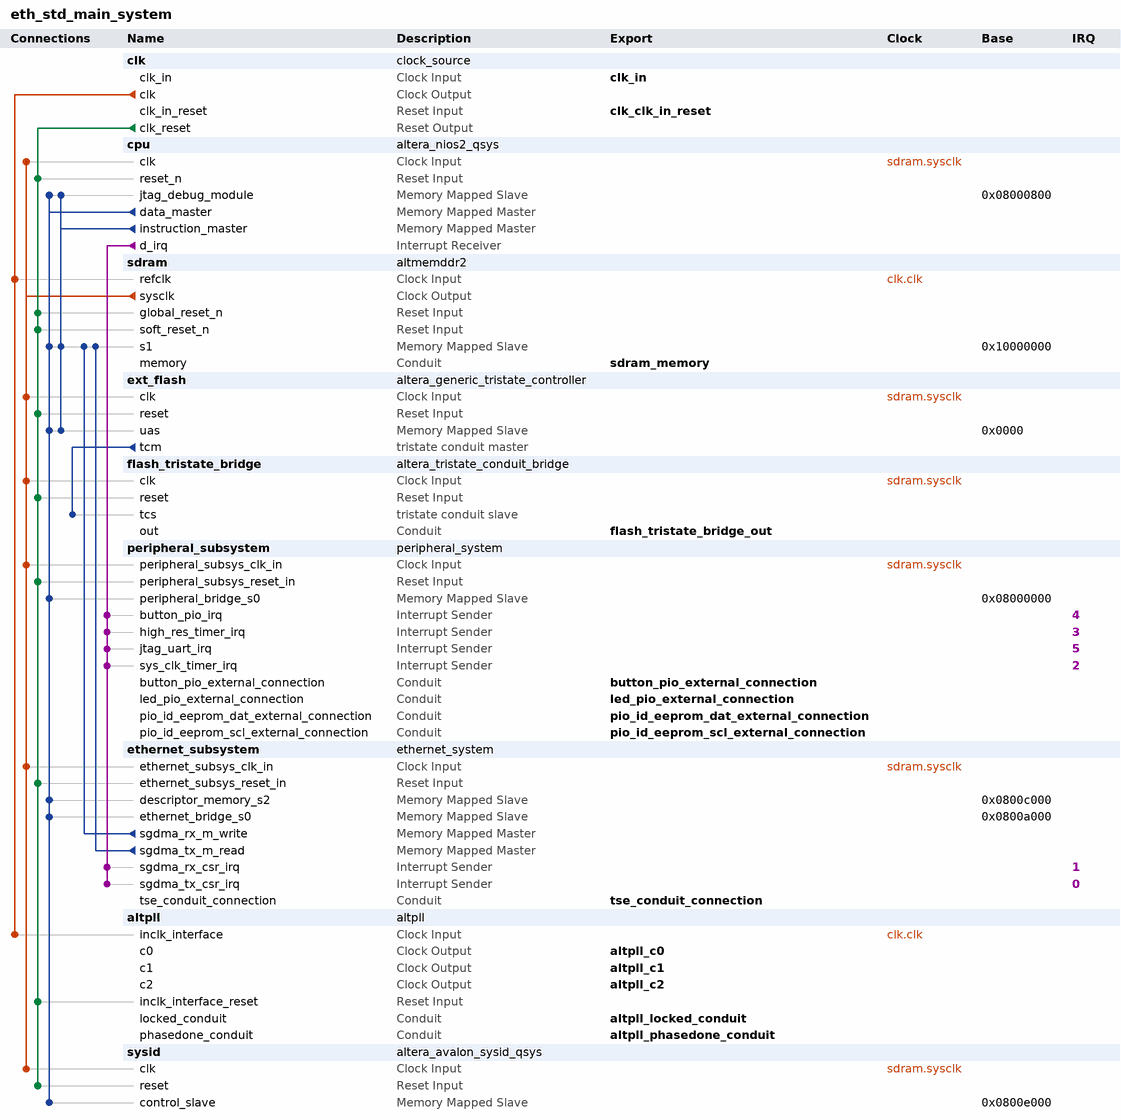
[diagram p0: system contents]
# Platform Designer (Qsys) system eth_std_main_system
# Parameters at their usual value, and those the tool derives, are not listed.
package require -exact qsys 11.0
create_system eth_std_main_system
set_project_property DEVICE_FAMILY CYCLONEIII

add_instance clk clock_source 11.0
set_instance_parameter_value clk clockFrequency 50000000

add_instance cpu altera_nios2_qsys 11.0
set_instance_parameter_value cpu muldiv_divider true
set_instance_parameter_value cpu mmu_autoAssignTlbPtrSz false
set_instance_parameter_value cpu manuallyAssignCpuID false
set_instance_parameter_value cpu exceptionOffset 288
set_instance_parameter_value cpu resetSlave ext_flash.uas
set_instance_parameter_value cpu exceptionSlave sdram.s1
set_instance_parameter_value cpu breakSlave cpu.jtag_debug_module
set_instance_parameter_value cpu impl Fast
set_instance_parameter_value cpu icache_size 32768
set_instance_parameter_value cpu dcache_size 32768

add_instance sdram altmemddr2 11.0
set_instance_parameter_value sdram pipeline_commands true
set_instance_parameter_value sdram debug_en false
set_instance_parameter_value sdram export_debug_port false
set_instance_parameter_value sdram use_generated_memory_model true
set_instance_parameter_value sdram dedicated_memory_clk_phase_label {Dedicated memory clock phase:}
set_instance_parameter_value sdram mem_if_clk_mhz 125.0
set_instance_parameter_value sdram quartus_project_exists false
set_instance_parameter_value sdram local_if_drate Half
set_instance_parameter_value sdram enable_v72_rsu false
set_instance_parameter_value sdram local_if_clk_mhz_label 62.5
set_instance_parameter_value sdram new_variant true
set_instance_parameter_value sdram mem_if_memtype {DDR2 SDRAM}
set_instance_parameter_value sdram pll_ref_clk_mhz 50.0
set_instance_parameter_value sdram mem_if_clk_ps_label {(8000 ps)}
set_instance_parameter_value sdram family {Cyclone III}
set_instance_parameter_value sdram project_family {Cyclone III}
set_instance_parameter_value sdram speed_grade 7
set_instance_parameter_value sdram dedicated_memory_clk_phase 0
set_instance_parameter_value sdram pll_ref_clk_ps_label {(20000 ps)}
set_instance_parameter_value sdram avalon_burst_length 1
set_instance_parameter_value sdram mem_if_clk_pair_count 1
set_instance_parameter_value sdram mem_if_cs_per_dimm 1
set_instance_parameter_value sdram pre_latency_label {Fix read latency at:}
set_instance_parameter_value sdram dedicated_memory_clk_en false
set_instance_parameter_value sdram mirror_addressing 0
set_instance_parameter_value sdram mem_if_bankaddr_width 2
set_instance_parameter_value sdram register_control_word_9 0000
set_instance_parameter_value sdram mem_if_rowaddr_width 13
set_instance_parameter_value sdram mem_dyn_deskew_en false
set_instance_parameter_value sdram post_latency_label {cycles (0 cycles=minimum latency, non-deterministic)}
set_instance_parameter_value sdram mem_if_dm_pins_en Yes
set_instance_parameter_value sdram local_if_dwidth_label 32
set_instance_parameter_value sdram register_control_word_7 0000
set_instance_parameter_value sdram register_control_word_8 0000
set_instance_parameter_value sdram mem_if_preset {Custom (Micron MT47H32M16CC-3)}
set_instance_parameter_value sdram mem_if_pchaddr_bit 10
set_instance_parameter_value sdram WIDTH_RATIO 4
set_instance_parameter_value sdram vendor Micron
set_instance_parameter_value sdram register_control_word_3 0000
set_instance_parameter_value sdram register_control_word_4 0000
set_instance_parameter_value sdram chip_or_dimm {Discrete Device}
set_instance_parameter_value sdram register_control_word_5 0000
set_instance_parameter_value sdram register_control_word_6 0000
set_instance_parameter_value sdram mem_fmax 333.333
set_instance_parameter_value sdram register_control_word_0 0000
set_instance_parameter_value sdram register_control_word_size 4
set_instance_parameter_value sdram register_control_word_1 0000
set_instance_parameter_value sdram register_control_word_2 0000
set_instance_parameter_value sdram register_control_word_11 0000
set_instance_parameter_value sdram register_control_word_10 0000
set_instance_parameter_value sdram mem_if_cs_width 1
set_instance_parameter_value sdram mem_if_preset_rlat 0
set_instance_parameter_value sdram mem_if_cs_per_rank 1
set_instance_parameter_value sdram fast_simulation_en FAST
set_instance_parameter_value sdram register_control_word_15 0000
set_instance_parameter_value sdram register_control_word_14 0000
set_instance_parameter_value sdram mem_if_dwidth 8
set_instance_parameter_value sdram mem_if_dq_per_dqs 8
set_instance_parameter_value sdram mem_if_coladdr_width 10
set_instance_parameter_value sdram register_control_word_13 0000
set_instance_parameter_value sdram register_control_word_12 0000
set_instance_parameter_value sdram mem_tiha_ps 400
set_instance_parameter_value sdram mem_tdsh_ck 0.2
set_instance_parameter_value sdram mem_if_trfc_ns 105.0
set_instance_parameter_value sdram mem_tqh_ck 0.36
set_instance_parameter_value sdram mem_tisa_ps 400
set_instance_parameter_value sdram mem_tdss_ck 0.2
set_instance_parameter_value sdram mem_trtp_ns 8.8
set_instance_parameter_value sdram mem_if_tinit_us 200.0
set_instance_parameter_value sdram mem_if_trcd_ns 15.0
set_instance_parameter_value sdram mem_if_twtr_ck 3
set_instance_parameter_value sdram mem_trrd_ns 10.0
set_instance_parameter_value sdram mem_tdqss_ck 0.25
set_instance_parameter_value sdram mem_tqhs_ps 340
set_instance_parameter_value sdram mem_tdsa_ps 300
set_instance_parameter_value sdram mem_tac_ps 450
set_instance_parameter_value sdram mem_tdha_ps 300
set_instance_parameter_value sdram mem_if_tras_ns 40.0
set_instance_parameter_value sdram mem_if_twr_ns 15.0
set_instance_parameter_value sdram mem_tdqsck_ps 400
set_instance_parameter_value sdram mem_if_trp_ns 15.0
set_instance_parameter_value sdram mem_tdqsq_ps 240
set_instance_parameter_value sdram mem_if_tmrd_ns 6.0
set_instance_parameter_value sdram mem_tfaw_ns 50.0
set_instance_parameter_value sdram mem_if_trefi_us 7.8
set_instance_parameter_value sdram mem_tcl_40_fmax 266.667
set_instance_parameter_value sdram mem_odt 50
set_instance_parameter_value sdram mp_WLH_percent 0.6
set_instance_parameter_value sdram mem_drv_str Reduced
set_instance_parameter_value sdram mp_DH_percent 0.5
set_instance_parameter_value sdram input_period 0
set_instance_parameter_value sdram mp_QH_percent 0.5
set_instance_parameter_value sdram mp_QHS_percent 0.5
set_instance_parameter_value sdram mem_tcl_30_fmax 200.0
set_instance_parameter_value sdram ac_clk_select 90
set_instance_parameter_value sdram mp_DQSQ_percent 0.65
set_instance_parameter_value sdram mp_DS_percent 0.6
set_instance_parameter_value sdram pll_reconfig_ports_en false
set_instance_parameter_value sdram mem_btype Sequential
set_instance_parameter_value sdram mp_IS_percent 0.7
set_instance_parameter_value sdram mem_tcl 3.0
set_instance_parameter_value sdram mp_DQSS_percent 0.5
set_instance_parameter_value sdram export_bank_info false
set_instance_parameter_value sdram mp_DSS_percent 0.6
set_instance_parameter_value sdram mem_dll_en Yes
set_instance_parameter_value sdram ac_phase 90
set_instance_parameter_value sdram mem_if_oct_en false
set_instance_parameter_value sdram mem_tcl_60_fmax 333.333
set_instance_parameter_value sdram mp_DSH_percent 0.6
set_instance_parameter_value sdram mem_if_dqsn_en false
set_instance_parameter_value sdram enable_mp_calibration true
set_instance_parameter_value sdram mp_IH_percent 0.6
set_instance_parameter_value sdram mem_tcl_15_fmax 533.0
set_instance_parameter_value sdram dll_external false
set_instance_parameter_value sdram mem_bl 8
set_instance_parameter_value sdram mp_WLS_percent 0.7
set_instance_parameter_value sdram mem_tcl_50_fmax 333.333
set_instance_parameter_value sdram mp_DQSCK_percent 0.5
set_instance_parameter_value sdram mem_tcl_25_fmax 533.0
set_instance_parameter_value sdram mem_tcl_20_fmax 533.0
set_instance_parameter_value sdram cfg_reorder_data false
set_instance_parameter_value sdram ctl_ecc_en false
set_instance_parameter_value sdram ctl_hrb_en false
set_instance_parameter_value sdram ref_clk_source clk
set_instance_parameter_value sdram cfg_data_reordering_type INTER_ROW
set_instance_parameter_value sdram ctl_powerdn_en false
set_instance_parameter_value sdram multicast_wr_en false
set_instance_parameter_value sdram auto_powerdn_cycles 0
set_instance_parameter_value sdram ctl_self_refresh_en false
set_instance_parameter_value sdram cfg_starve_limit 4
set_instance_parameter_value sdram ctl_latency 0
set_instance_parameter_value sdram tool_context SOPC_BUILDER
set_instance_parameter_value sdram mem_addr_mapping CHIP_ROW_BANK_COL
set_instance_parameter_value sdram burst_merge_en false
set_instance_parameter_value sdram user_refresh_en false
set_instance_parameter_value sdram qsys_mode true
set_instance_parameter_value sdram clk_source_sharing_en false
set_instance_parameter_value sdram ctl_lookahead_depth 4
set_instance_parameter_value sdram ctl_autopch_en false
set_instance_parameter_value sdram ctl_dynamic_bank_allocation false
set_instance_parameter_value sdram ctl_dynamic_bank_num 4
set_instance_parameter_value sdram local_if_type_avalon true
set_instance_parameter_value sdram csr_en false
set_instance_parameter_value sdram ctl_auto_correct_en false
set_instance_parameter_value sdram auto_powerdn_en false
set_instance_parameter_value sdram phy_if_type_afi true
set_instance_parameter_value sdram controller_type ngv110_ctl
set_instance_parameter_value sdram max_local_size 1
set_instance_parameter_value sdram mem_srtr Normal
set_instance_parameter_value sdram mem_mpr_loc {Predefined Pattern}
set_instance_parameter_value sdram dss_tinit_rst_us 200.0
set_instance_parameter_value sdram mem_tcl_90_fmax 400.0
set_instance_parameter_value sdram mem_rtt_wr {Dynamic ODT off}
set_instance_parameter_value sdram mem_tcl_100_fmax 400.0
set_instance_parameter_value sdram mem_pasr {Full Array}
set_instance_parameter_value sdram mem_asrm {Manual SR Reference (SRT)}
set_instance_parameter_value sdram mem_mpr_oper {Predefined Pattern}
set_instance_parameter_value sdram mem_tcl_80_fmax 400.0
set_instance_parameter_value sdram mem_drv_impedance RZQ/7
set_instance_parameter_value sdram mem_rtt_nom {ODT Disabled}
set_instance_parameter_value sdram mem_tcl_70_fmax 400.0
set_instance_parameter_value sdram mem_wtcl 5.0
set_instance_parameter_value sdram mem_dll_pch {Fast Exit}
set_instance_parameter_value sdram mem_atcl Disabled
set_instance_parameter_value sdram board_settings_valid true
set_instance_parameter_value sdram t_IH 0.4
set_instance_parameter_value sdram board_intra_DQS_group_skew 0.05
set_instance_parameter_value sdram isi_DQS 0.0
set_instance_parameter_value sdram addr_cmd_slew_rate 1.0
set_instance_parameter_value sdram board_tpd_inter_DIMM 0.05
set_instance_parameter_value sdram board_addresscmd_CK_skew 0.0
set_instance_parameter_value sdram t_DS_calculated 0.300
set_instance_parameter_value sdram isi_addresscmd_hold 0.0
set_instance_parameter_value sdram t_IS 0.4
set_instance_parameter_value sdram restore_default_toggle false
set_instance_parameter_value sdram dqs_dqsn_slew_rate 2.0
set_instance_parameter_value sdram dq_slew_rate 1.0
set_instance_parameter_value sdram board_inter_DQS_group_skew 0.02
set_instance_parameter_value sdram isi_addresscmd_setup 0.0
set_instance_parameter_value sdram board_minCK_DQS_skew -0.01
set_instance_parameter_value sdram t_IS_calculated 0.400
set_instance_parameter_value sdram num_slots_or_devices 1
set_instance_parameter_value sdram board_maxCK_DQS_skew 0.01
set_instance_parameter_value sdram board_skew_ps 50
set_instance_parameter_value sdram t_DH 0.3
set_instance_parameter_value sdram ck_ckn_slew_rate 2.0
set_instance_parameter_value sdram isi_DQ 0.0
set_instance_parameter_value sdram t_IH_calculated 0.400
set_instance_parameter_value sdram t_DH_calculated 0.300
set_instance_parameter_value sdram t_DS 0.3

add_instance ext_flash altera_generic_tristate_controller 11.0
set_instance_parameter_value ext_flash TCM_ADDRESS_W 26
set_instance_parameter_value ext_flash TCM_DATA_W 16
set_instance_parameter_value ext_flash TCM_BYTEENABLE_W 2
set_instance_parameter_value ext_flash TCM_READ_WAIT 35
set_instance_parameter_value ext_flash TCM_WRITE_WAIT 35
set_instance_parameter_value ext_flash TCM_SETUP_WAIT 75
set_instance_parameter_value ext_flash TCM_DATA_HOLD 1
set_instance_parameter_value ext_flash TCM_MAX_PENDING_READ_TRANSACTIONS 3
set_instance_parameter_value ext_flash TCM_TURNAROUND_TIME 2
set_instance_parameter_value ext_flash TCM_TIMING_UNITS 0
set_instance_parameter_value ext_flash TCM_READLATENCY 2
set_instance_parameter_value ext_flash TCM_SYMBOLS_PER_WORD 2
set_instance_parameter_value ext_flash USE_READ 1
set_instance_parameter_value ext_flash USE_BEGINTRANSFER 0
set_instance_parameter_value ext_flash USE_BYTEENABLE 0
set_instance_parameter_value ext_flash USE_OUTPUTENABLE 0
set_instance_parameter_value ext_flash ACTIVE_LOW_READ 1
set_instance_parameter_value ext_flash ACTIVE_LOW_BYTEENABLE 0
set_instance_parameter_value ext_flash ACTIVE_LOW_OUTPUTENABLE 0
set_instance_parameter_value ext_flash ACTIVE_LOW_BEGINTRANSFER 0
set_instance_parameter_value ext_flash CHIPSELECT_THROUGH_READLATENCY 0
set_instance_parameter_value ext_flash MODULE_ASSIGNMENT_KEYS embeddedsw.configuration.softwareDriver,embeddedsw.CMacro.SETUP_VALUE,embeddedsw.CMacro.WAIT_VALUE,embeddedsw.CMacro.HOLD_VALUE,embeddedsw.CMacro.TIMING_UNITS,embeddedsw.CMacro.SIZE,embeddedsw.memoryInfo.MEM_INIT_DATA_WIDTH,embeddedsw.memoryInfo.HAS_BYTE_LANE,embeddedsw.memoryInfo.IS_FLASH,embeddedsw.memoryInfo.GENERATE_DAT_SYM,embeddedsw.memoryInfo.GENERATE_FLASH,embeddedsw.memoryInfo.DAT_SYM_INSTALL_DIR,embeddedsw.memoryInfo.FLASH_INSTALL_DIR
set_instance_parameter_value ext_flash MODULE_ASSIGNMENT_VALUES {altera_avalon_cfi_flash_driver,75,35,1,"ns",67108864u,16,1,1,1,1,SIM_DIR,APP_DIR}
set_instance_parameter_value ext_flash INTERFACE_ASSIGNMENT_KEYS embeddedsw.configuration.isFlash,embeddedsw.configuration.isMemoryDevice,embeddedsw.configuration.isNonVolatileStorage
set_instance_parameter_value ext_flash INTERFACE_ASSIGNMENT_VALUES 1,1,1

add_instance flash_tristate_bridge altera_tristate_conduit_bridge 11.0

add_instance peripheral_subsystem peripheral_system 1.0

add_instance ethernet_subsystem ethernet_system 1.0

add_instance altpll altpll 11.0
set_instance_parameter_value altpll INCLK0_INPUT_FREQUENCY 20000
set_instance_parameter_value altpll CLK0_MULTIPLY_BY 5
set_instance_parameter_value altpll CLK1_MULTIPLY_BY 1
set_instance_parameter_value altpll CLK2_MULTIPLY_BY 1
set_instance_parameter_value altpll CLK0_DIVIDE_BY 2
set_instance_parameter_value altpll CLK1_DIVIDE_BY 2
set_instance_parameter_value altpll CLK2_DIVIDE_BY 20
set_instance_parameter_value altpll CLK1_PHASE_SHIFT 0
set_instance_parameter_value altpll CLK2_PHASE_SHIFT 0
set_instance_parameter_value altpll CLK1_DUTY_CYCLE 50
set_instance_parameter_value altpll CLK2_DUTY_CYCLE 50
set_instance_parameter_value altpll PORT_clk1 PORT_USED
set_instance_parameter_value altpll PORT_clk2 PORT_USED
set_instance_parameter_value altpll PORT_clk3 PORT_UNUSED
set_instance_parameter_value altpll PORT_ARESET PORT_USED
set_instance_parameter_value altpll PORT_LOCKED PORT_USED

add_instance sysid altera_avalon_sysid_qsys 11.0
set_instance_parameter_value sysid id 0

# connections
add_connection clk.clk altpll.inclk_interface clock
add_connection clk.clk sdram.refclk clock
add_connection sdram.sysclk cpu.clk clock
add_connection sdram.sysclk ethernet_subsystem.ethernet_subsys_clk_in clock
add_connection sdram.sysclk ext_flash.clk clock
add_connection sdram.sysclk flash_tristate_bridge.clk clock
add_connection sdram.sysclk peripheral_subsystem.peripheral_subsys_clk_in clock
add_connection sdram.sysclk sysid.clk clock
add_connection clk.clk_reset altpll.inclk_interface_reset reset
add_connection clk.clk_reset cpu.reset_n reset
add_connection clk.clk_reset ethernet_subsystem.ethernet_subsys_reset_in reset
add_connection clk.clk_reset ext_flash.reset reset
add_connection clk.clk_reset flash_tristate_bridge.reset reset
add_connection clk.clk_reset peripheral_subsystem.peripheral_subsys_reset_in reset
add_connection clk.clk_reset sdram.global_reset_n reset
add_connection clk.clk_reset sdram.soft_reset_n reset
add_connection clk.clk_reset sysid.reset reset
add_connection cpu.data_master cpu.jtag_debug_module avalon
set_connection_parameter_value cpu.data_master/cpu.jtag_debug_module baseAddress 0x08000800
add_connection cpu.data_master ethernet_subsystem.descriptor_memory_s2 avalon
set_connection_parameter_value cpu.data_master/ethernet_subsystem.descriptor_memory_s2 baseAddress 0x0800c000
add_connection cpu.data_master ethernet_subsystem.ethernet_bridge_s0 avalon
set_connection_parameter_value cpu.data_master/ethernet_subsystem.ethernet_bridge_s0 baseAddress 0x0800a000
add_connection cpu.data_master ext_flash.uas avalon
set_connection_parameter_value cpu.data_master/ext_flash.uas baseAddress 0x0000
add_connection cpu.data_master peripheral_subsystem.peripheral_bridge_s0 avalon
set_connection_parameter_value cpu.data_master/peripheral_subsystem.peripheral_bridge_s0 baseAddress 0x08000000
add_connection cpu.data_master sdram.s1 avalon
set_connection_parameter_value cpu.data_master/sdram.s1 baseAddress 0x10000000
add_connection cpu.data_master sysid.control_slave avalon
set_connection_parameter_value cpu.data_master/sysid.control_slave baseAddress 0x0800e000
add_connection cpu.instruction_master cpu.jtag_debug_module avalon
set_connection_parameter_value cpu.instruction_master/cpu.jtag_debug_module baseAddress 0x08000800
add_connection cpu.instruction_master ext_flash.uas avalon
set_connection_parameter_value cpu.instruction_master/ext_flash.uas baseAddress 0x0000
add_connection cpu.instruction_master sdram.s1 avalon
set_connection_parameter_value cpu.instruction_master/sdram.s1 baseAddress 0x10000000
add_connection ethernet_subsystem.sgdma_rx_m_write sdram.s1 avalon
set_connection_parameter_value ethernet_subsystem.sgdma_rx_m_write/sdram.s1 baseAddress 0x10000000
add_connection ethernet_subsystem.sgdma_tx_m_read sdram.s1 avalon
set_connection_parameter_value ethernet_subsystem.sgdma_tx_m_read/sdram.s1 baseAddress 0x10000000
add_connection cpu.d_irq ethernet_subsystem.sgdma_rx_csr_irq interrupt
set_connection_parameter_value cpu.d_irq/ethernet_subsystem.sgdma_rx_csr_irq irqNumber 1
add_connection cpu.d_irq ethernet_subsystem.sgdma_tx_csr_irq interrupt
set_connection_parameter_value cpu.d_irq/ethernet_subsystem.sgdma_tx_csr_irq irqNumber 0
add_connection cpu.d_irq peripheral_subsystem.button_pio_irq interrupt
set_connection_parameter_value cpu.d_irq/peripheral_subsystem.button_pio_irq irqNumber 4
add_connection cpu.d_irq peripheral_subsystem.high_res_timer_irq interrupt
set_connection_parameter_value cpu.d_irq/peripheral_subsystem.high_res_timer_irq irqNumber 3
add_connection cpu.d_irq peripheral_subsystem.jtag_uart_irq interrupt
set_connection_parameter_value cpu.d_irq/peripheral_subsystem.jtag_uart_irq irqNumber 5
add_connection cpu.d_irq peripheral_subsystem.sys_clk_timer_irq interrupt
set_connection_parameter_value cpu.d_irq/peripheral_subsystem.sys_clk_timer_irq irqNumber 2
add_connection ext_flash.tcm flash_tristate_bridge.tcs tristate_conduit

# exported interfaces
add_interface clk_in clock sink
set_interface_property clk_in EXPORT_OF clk.clk_in
add_interface flash_tristate_bridge_out conduit end
set_interface_property flash_tristate_bridge_out EXPORT_OF flash_tristate_bridge.out
add_interface tse_conduit_connection conduit end
set_interface_property tse_conduit_connection EXPORT_OF ethernet_subsystem.tse_conduit_connection
add_interface clk_clk_in_reset reset sink
set_interface_property clk_clk_in_reset EXPORT_OF clk.clk_in_reset
add_interface pio_id_eeprom_dat_external_connection conduit end
set_interface_property pio_id_eeprom_dat_external_connection EXPORT_OF peripheral_subsystem.pio_id_eeprom_dat_external_connection
add_interface led_pio_external_connection conduit end
set_interface_property led_pio_external_connection EXPORT_OF peripheral_subsystem.led_pio_external_connection
add_interface button_pio_external_connection conduit end
set_interface_property button_pio_external_connection EXPORT_OF peripheral_subsystem.button_pio_external_connection
add_interface pio_id_eeprom_scl_external_connection conduit end
set_interface_property pio_id_eeprom_scl_external_connection EXPORT_OF peripheral_subsystem.pio_id_eeprom_scl_external_connection
add_interface altpll_c0 clock source
set_interface_property altpll_c0 EXPORT_OF altpll.c0
add_interface altpll_c1 clock source
set_interface_property altpll_c1 EXPORT_OF altpll.c1
add_interface altpll_c2 clock source
set_interface_property altpll_c2 EXPORT_OF altpll.c2
add_interface altpll_locked_conduit conduit end
set_interface_property altpll_locked_conduit EXPORT_OF altpll.locked_conduit
add_interface altpll_phasedone_conduit conduit end
set_interface_property altpll_phasedone_conduit EXPORT_OF altpll.phasedone_conduit
add_interface sdram_memory conduit end
set_interface_property sdram_memory EXPORT_OF sdram.memory

save_system eth_std_main_system.qsys
